# EAGLE schematic stLink-cortex_adapter (EAGLE 6.5.0)
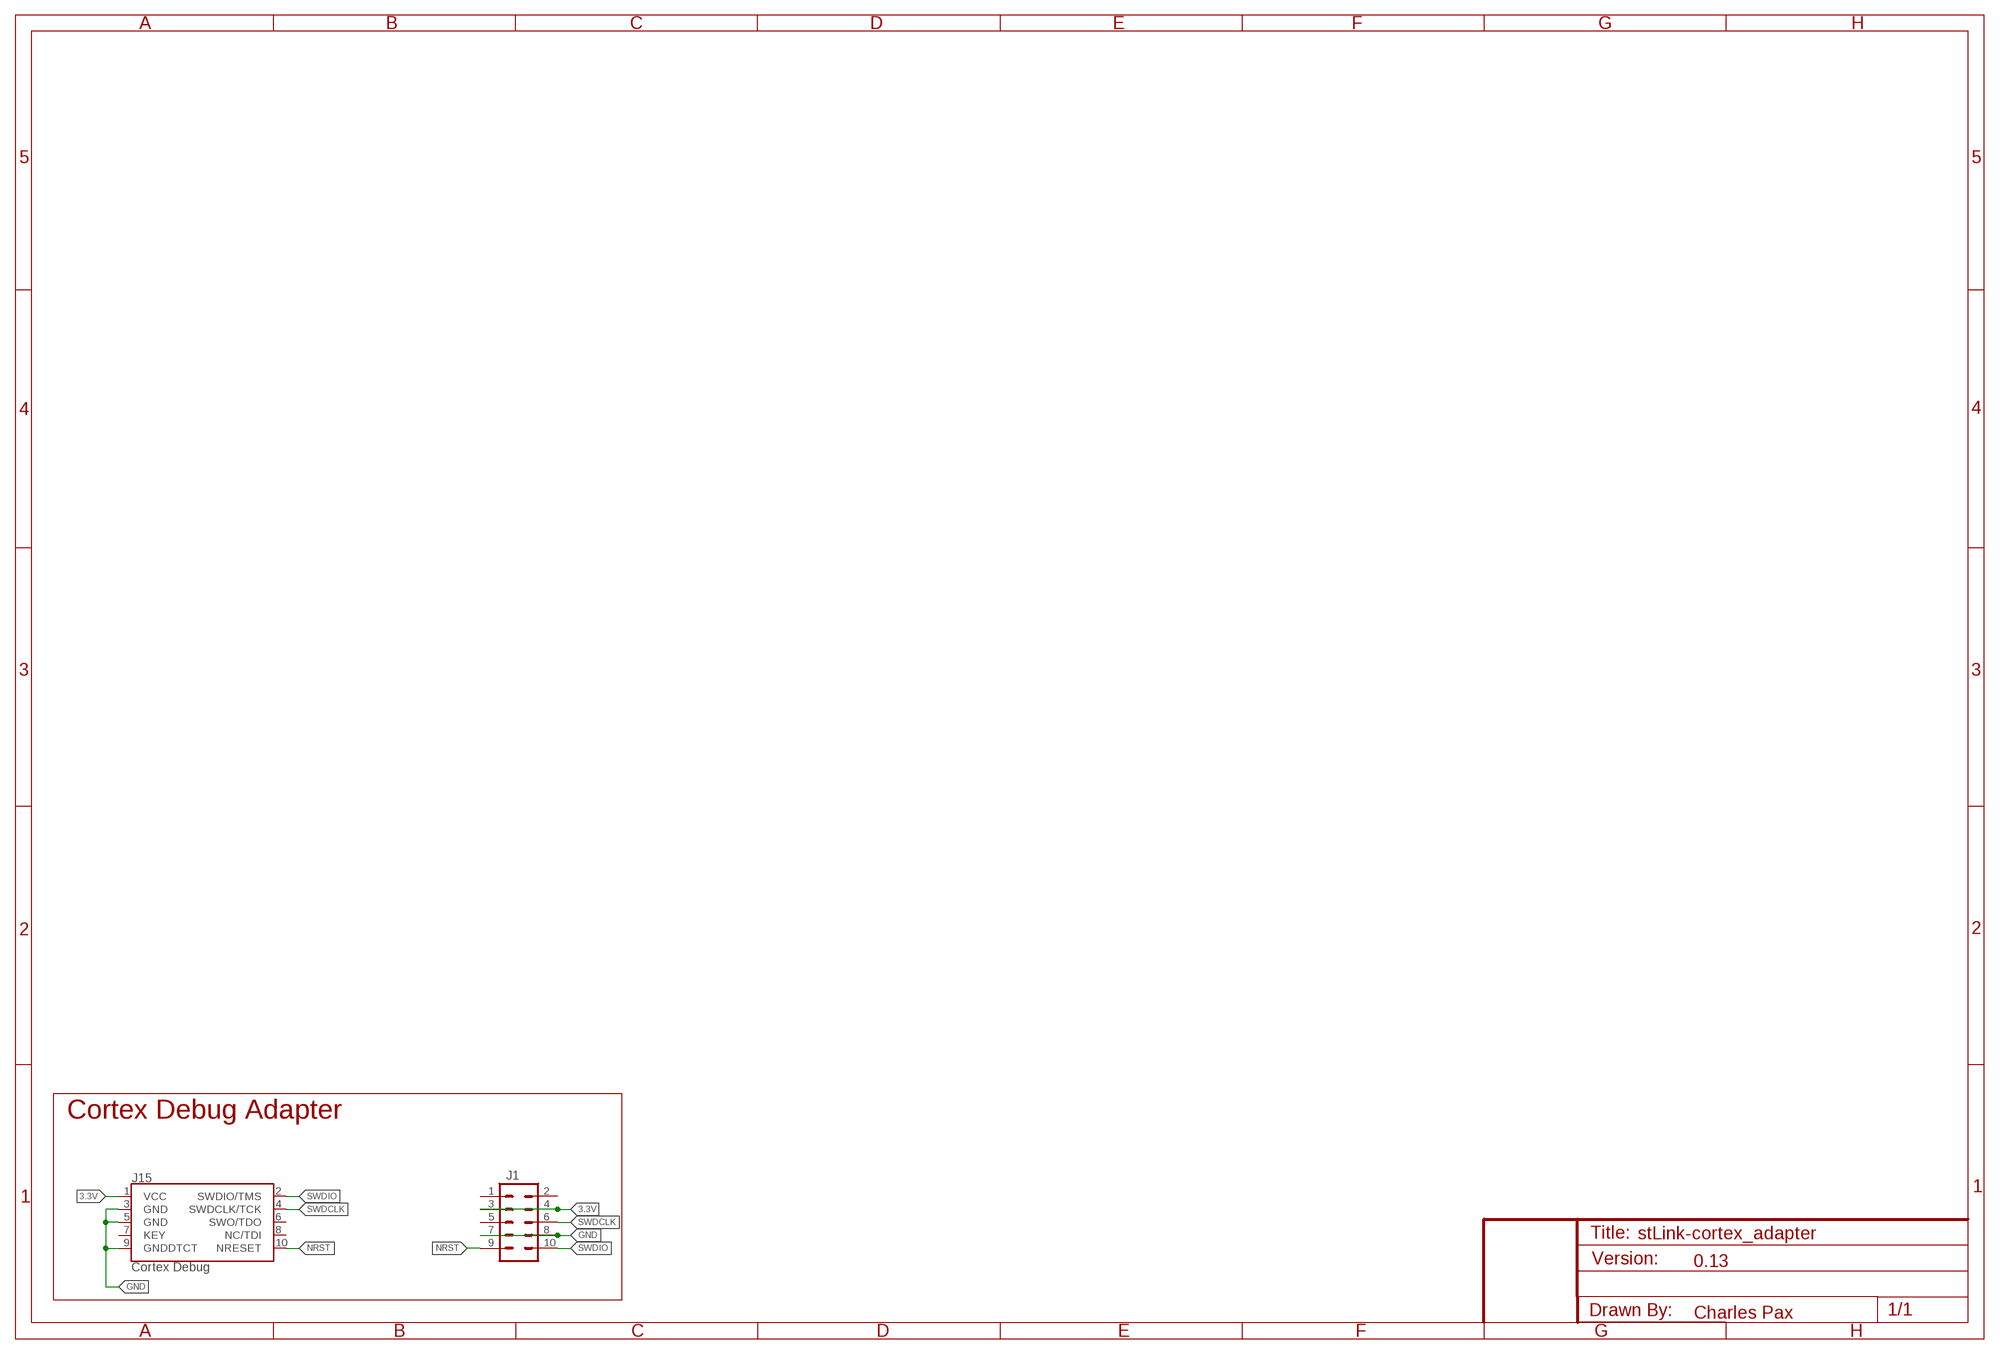
[diagram p0: schematic, sheet 1]

## Parts
J1  M05X2SHD_SMD  [2X5-SHROUDED_SMD]
J15  Cortex Debug  CORTEX_DEBUGSMD  [SAMTECH_FTSH-105-01]

## Nets
3.3V: J1.3 J1.4 J15.1(VCC)
GND [Ground]: J1.7 J1.8 J15.3(GND) J15.5(GND) J15.9(GNDDTCT)
NRST: J1.9 J15.10(NRESET)
SWDCLK: J1.6 J15.4(SWDCLK/TCK)
SWDIO: J1.10 J15.2(SWDIO/TMS)
Unconnected: J1.1 J1.2 J1.5 J15.6(SWO/TDO) J15.7(KEY) J15.8(NC/TDI)

## Notes on the sheet
- Cortex Debug Adapter
- 0.13
- Charles Pax

## Library data of the parts
J1 = SparkFun-Connectors:M05X2: Header 5x2 Standard 10-pin dual row 0.1" header. Commonly used with AVR-ISP. Use with Spark Fun Electronics SKU: PRT-00778
J15 = SparkFun-Connectors:CORTEX_DEBUG: Cortex Debug Connector Datasheet <http://infocenter.arm.com/help/topic/com.arm.doc.faqs/attached/13634/cortex_debug_connectors.pdf>

## Net classes
0 Digital signal: width 0.075 mm, drill 0.2 mm, clearance 0.075 mm
1 3.3V power: width 0.075 mm, drill 0.2 mm, clearance 0.075 mm
2 RTC battery: width 0.075 mm, drill 0.2 mm, clearance 0.075 mm
3 5V power: width 0.075 mm, drill 0.2 mm, clearance 0.075 mm
4 Analog signal: width 0.075 mm, drill 0.2 mm, clearance 0.075 mm
5 Ground: width 0.075 mm, drill 0.2 mm, clearance 0.075 mm